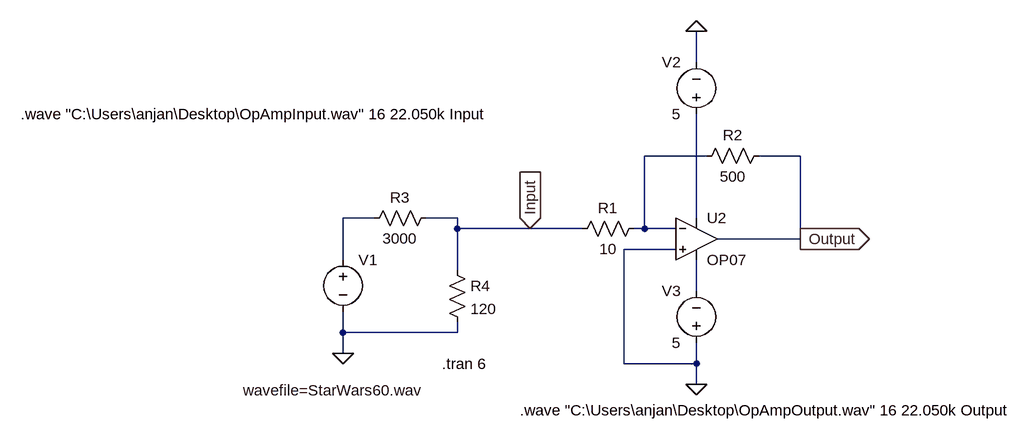
[diagram p0: schematic opAmpAmplifier.asc]
opAmpAmplifier.asc, the LTspice schematic file:
Version 4
SHEET 1 1464 680
WIRE 160 -96 160 -144
WIRE 176 48 80 48
WIRE 320 48 256 48
WIRE -336 144 -384 144
WIRE -208 144 -256 144
WIRE 160 144 160 -16
WIRE -208 160 -208 144
WIRE -96 160 -208 160
WIRE -16 160 -96 160
WIRE 80 160 80 48
WIRE 80 160 64 160
WIRE 128 160 80 160
WIRE 320 176 320 48
WIRE 320 176 192 176
WIRE 128 192 48 192
WIRE -384 208 -384 144
WIRE -208 224 -208 160
WIRE 160 256 160 208
WIRE -384 320 -384 288
WIRE -208 320 -208 304
WIRE -208 320 -384 320
WIRE -384 352 -384 320
WIRE 48 368 48 192
WIRE 160 368 160 336
WIRE 160 368 48 368
WIRE 160 400 160 368
FLAG -384 352 0
FLAG 160 400 0
FLAG 160 -144 0
FLAG -96 160 Input
IOPIN -96 160 In
FLAG 320 176 Output
IOPIN 320 176 Out
SYMBOL OpAmps\\OP07 160 112 R0
SYMATTR InstName U2
SYMBOL voltage -384 192 R0
WINDOW 3 -154 217 Left 2
SYMATTR Value wavefile=StarWars60.wav
SYMATTR InstName V1
SYMBOL res 80 144 R90
WINDOW 0 0 56 VBottom 2
WINDOW 3 32 56 VTop 2
SYMATTR InstName R1
SYMATTR Value 10
SYMBOL res 272 32 R90
WINDOW 0 0 56 VBottom 2
WINDOW 3 32 56 VTop 2
SYMATTR InstName R2
SYMATTR Value 500
SYMBOL voltage 160 0 R180
WINDOW 0 24 96 Left 2
WINDOW 3 24 16 Left 2
WINDOW 123 0 0 Left 0
WINDOW 39 0 0 Left 0
SYMATTR InstName V2
SYMATTR Value 5
SYMBOL voltage 160 352 R180
WINDOW 0 24 96 Left 2
WINDOW 3 24 16 Left 2
WINDOW 123 0 0 Left 0
WINDOW 39 0 0 Left 0
SYMATTR InstName V3
SYMATTR Value 5
SYMBOL res -240 128 R90
WINDOW 0 0 56 VBottom 2
WINDOW 3 32 56 VTop 2
SYMATTR InstName R3
SYMATTR Value 3000
SYMBOL res -224 208 R0
SYMATTR InstName R4
SYMATTR Value 120
TEXT -232 368 Left 2 !.tran 6
TEXT -112 440 Left 2 !.wave "C:\\Users\\anjan\\Desktop\\OpAmpOutput.wav" 16 22.050k Output
TEXT -880 -16 Left 2 !.wave "C:\\Users\\anjan\\Desktop\\OpAmpInput.wav" 16 22.050k Input

The netlist it stands for:
* opAmpAmplifier.asc
XU2 0 N001 N003 N004 Output LT1001  ; OP07, pins In+ In- V+ V- OUT
V1 N002 0 wavefile=StarWars60.wav
R1 N001 Input 10
R2 Output N001 500
V2 N003 0 5
V3 0 N004 5
R3 Input N002 3000
R4 Input 0 120
.tran 6
.wave "C:\Users\anjan\Desktop\OpAmpOutput.wav" 16 22.050k Output
.wave "C:\Users\anjan\Desktop\OpAmpInput.wav" 16 22.050k Input
.lib LTC.lib
.backanno
.end